# EAGLE design ehomeLight (EAGLE 8.6.3)
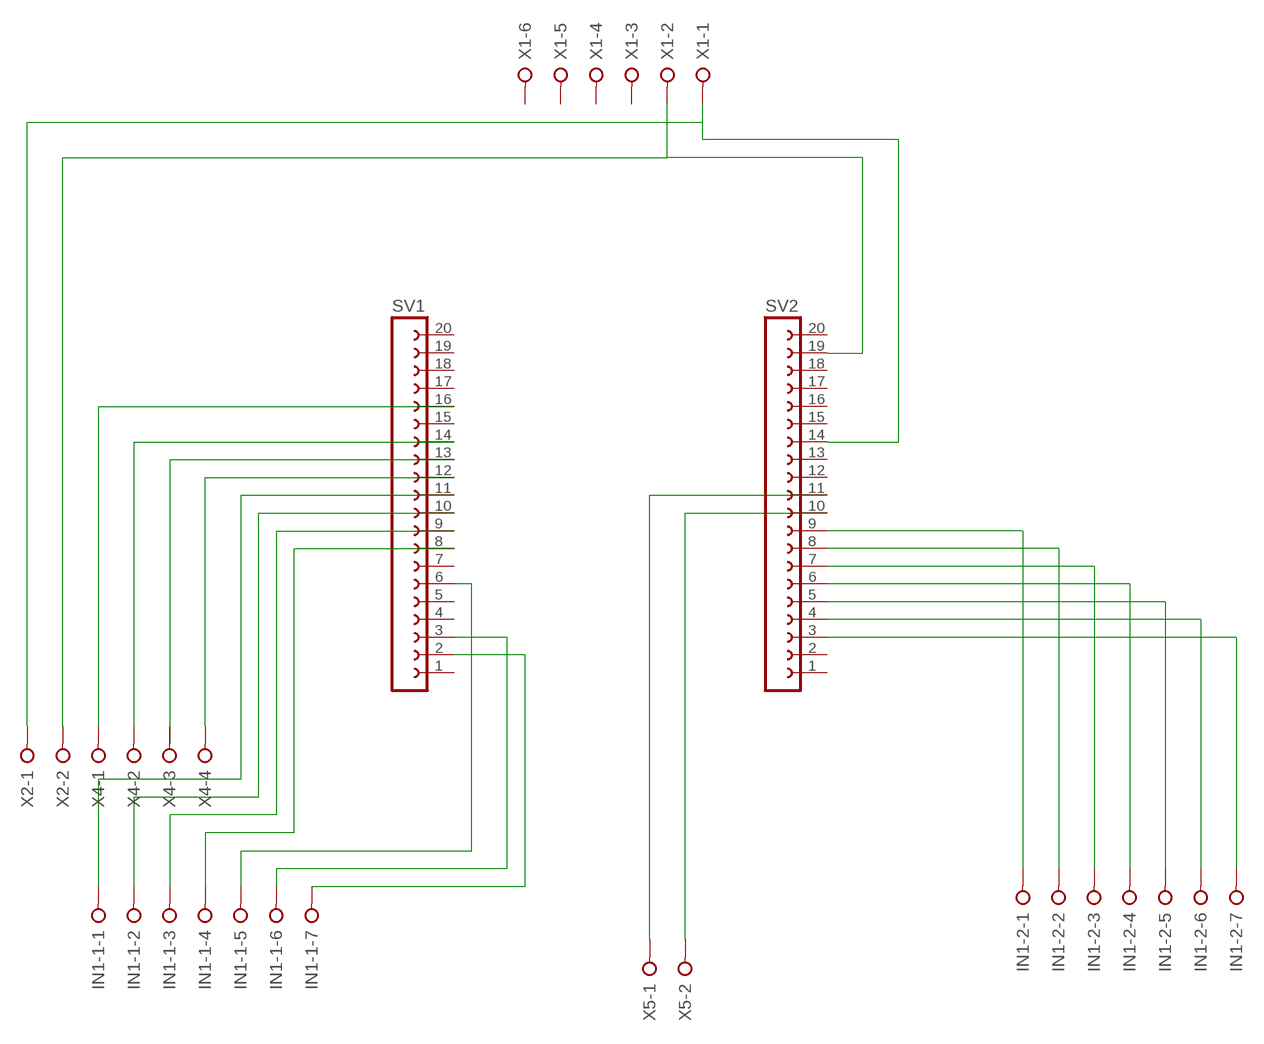
[diagram p0: schematic, sheet 1]

## Parts
IN1-1  W237-07P  [W237-7P]
IN1-2  W237-07P  [W237-7P]
SV1  FE20-1  [FE20]
SV2  FE20-1  [FE20]
X1  W237-06P  [W237-6P]
X2  W237-02P  [W237-132]
X4  W237-04P  [W237-4P]
X5  W237-02P  [W237-132]

## Nets
GND: SV2.14 X1.1 X2.1
GPIO0: SV1.14 X4.2
GPIO4: SV1.13 X4.3
GPIO5: IN1-1.2 SV1.10
GPIO15: SV1.16 X4.1
GPIO16: SV1.12 X4.4
GPIO17: IN1-1.1 SV1.11
GPIO18: IN1-1.3 SV1.9
GPIO19: IN1-1.4 SV1.8
GPIO21: IN1-1.5 SV1.6
GPIO22: IN1-1.6 SV1.3
GPIO23: IN1-1.7 SV1.2
GPIO25: IN1-2.1 SV2.9
GPIO26: SV2.10 X5.2
GPIO27: SV2.11 X5.1
GPIO32: IN1-2.3 SV2.7
GPIO33: IN1-2.2 SV2.8
GPIO34: IN1-2.5 SV2.5
GPIO35: IN1-2.4 SV2.6
GPIO36: IN1-2.7 SV2.3
GPIO39: IN1-2.6 SV2.4
PWR: SV2.19 X1.2 X2.2
Unconnected: SV1.1 SV1.4 SV1.5 SV1.7 SV1.15 SV1.17 SV1.18 SV1.19 SV1.20 SV2.1 SV2.2 SV2.12 SV2.13 SV2.15 SV2.16 SV2.17 SV2.18 SV2.20 X1.3 X1.4 X1.5 X1.6

## Library data of the parts
IN1-1 IN1-2 = con-wago-508:W237-07P: WAGO SREW CLAMP; OC_FARNELL: unknown; OC_NEWARK: unknown
SV1 SV2 = con-lsta:FE20-1: FEMALE HEADER; OC_FARNELL: unknown; OC_NEWARK: unknown
X1 = con-wago-508:W237-06P: WAGO SREW CLAMP; OC_FARNELL: unknown; OC_NEWARK: unknown
X2 X5 = con-wago-508:W237-02P: WAGO SREW CLAMP; OC_FARNELL: unknown; OC_NEWARK: unknown
X4 = con-wago-508:W237-04P: WAGO SREW CLAMP; OC_FARNELL: unknown; OC_NEWARK: unknown

## Board
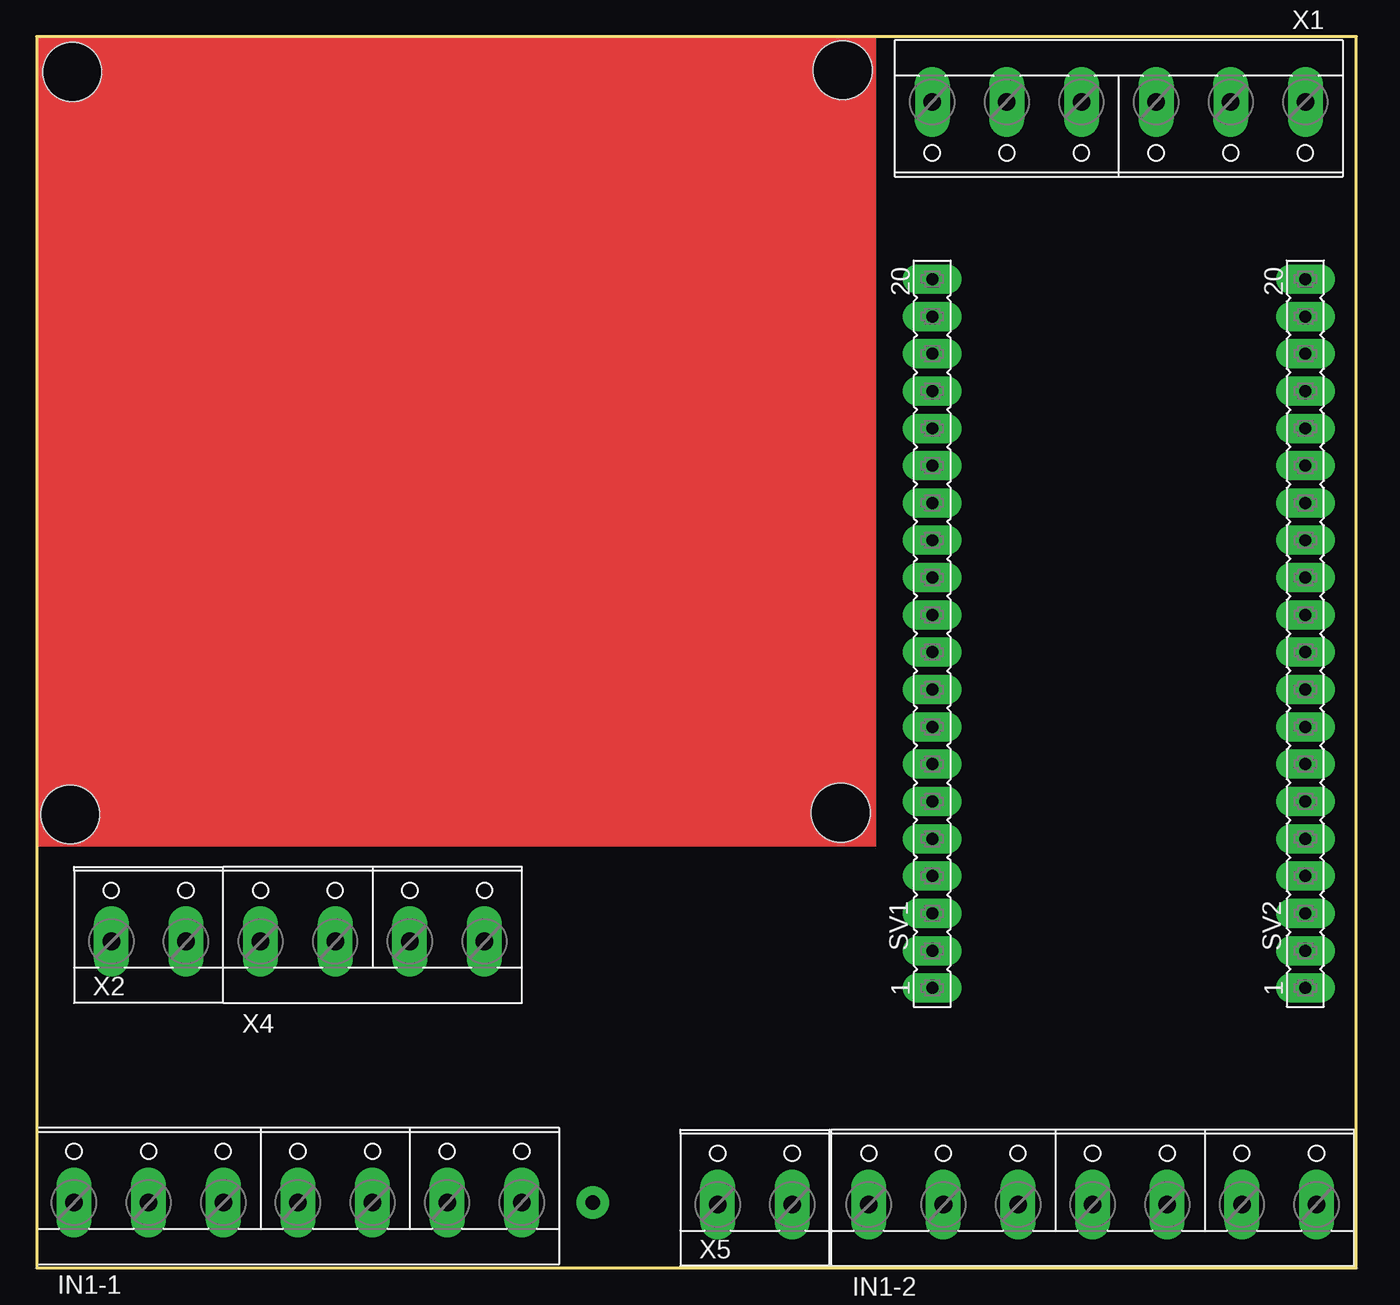
[diagram p1: board, top side]
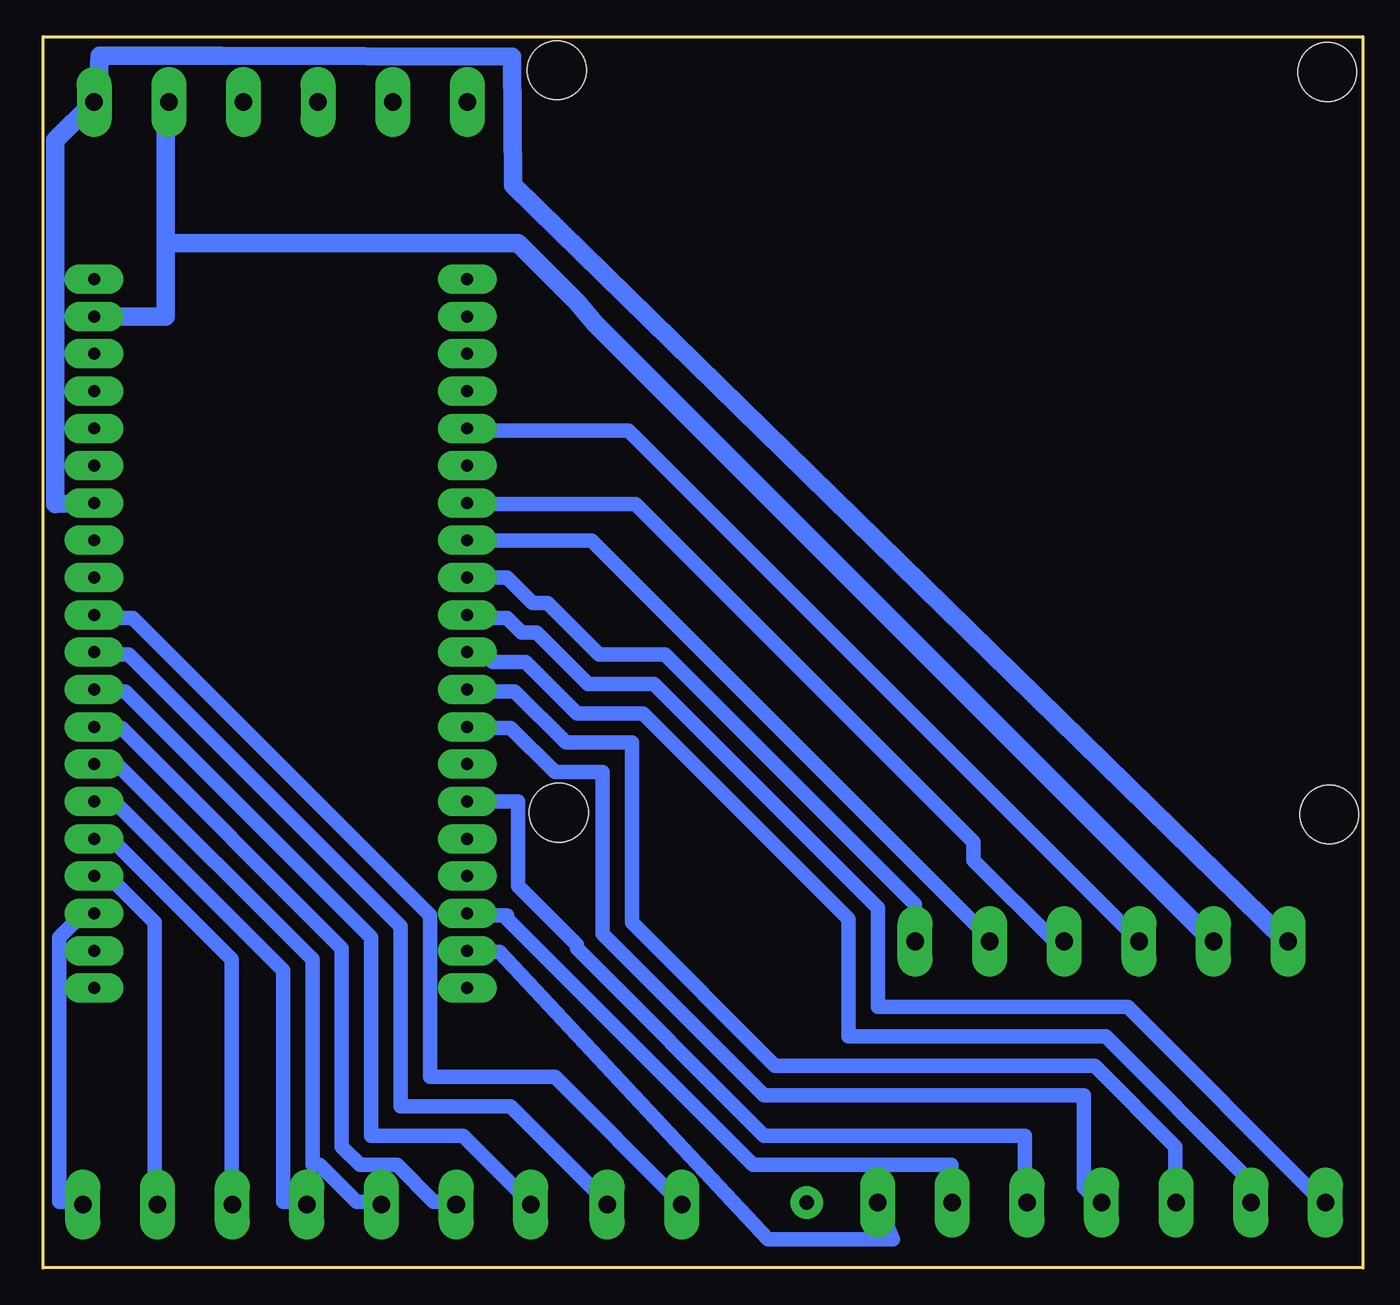
[diagram p2: board, bottom side, seen from below]

Size 89.84 x 83.81 mm. Coordinates in mm from the lower left corner, seen from the top.
Outline: 0,0 89.84,0 89.84,83.81 0,83.81 0,0
Copper layers (1*16): Top 0.035mm / dielectric 1.5mm / Bottom 0.035mm
Design rules "hobby *": minimum track width 1mm, minimum drill 1mm, track to track 0.8mm, track to pad 0.8mm, pad to pad 0.45mm, via to via 0.8mm, smd to smd 8mil, copper to edge 10mil, drill to drill 8mil, minimum pad ring 0.6mm, minimum via ring 0.6mm, stop-mask expansion 0mil, vias tented up to drill 0mil, thermal gap 10mil
Holes 4 mm at 2.41,81.41 54.86,81.53 2.29,30.86 54.74,30.99

### Footprints (pad centres in the part's own frame; a part is rotated, then mirrored left to right if it is on the bottom)
W237-7P = drill 1.194 long: 1 -15.24,-0.635; 2 -10.16,-0.635; 3 -5.08,-0.635; 4 0,-0.635; 5 5.08,-0.635; 6 10.16,-0.635; 7 15.24,-0.635
FE20 = drill 0.813 long: 1 -24.13,0; 2 -21.59,0; 3 -19.05,0; 4 -16.51,0; 5 -13.97,0; 6 -11.43,0; 7 -8.89,0; 8 -6.35,0; 9 -3.81,0; 10 -1.27,0; 11 1.27,0; 12 3.81,0; 13 6.35,0; 14 8.89,0; 15 11.43,0; 16 13.97,0; 17 16.51,0; 18 19.05,0; 19 21.59,0; 20 24.13,0
W237-6P = drill 1.194 long: 1 -12.7,-0.635; 2 -7.62,-0.635; 3 -2.54,-0.635; 4 2.54,-0.635; 5 7.62,-0.635; 6 12.7,-0.635
W237-132 = drill 1.194 long: 1 -2.54,-0.635; 2 2.54,-0.635
W237-4P = drill 1.194 long: 1 -7.62,-0.635; 2 -2.54,-0.635; 3 2.54,-0.635; 4 7.62,-0.635

### Placement (x,y rotation side)
IN1-1  17.78,5.08 0 top
IN1-2  71.88,4.95 0 top
SV1  60.96,43.18 90 top
SV2  86.36,43.18 90 top
X1  73.66,78.74 180 top
X2  7.62,22.86 0 top
X4  22.86,22.86 0 top
X5  48.9,4.95 0 top

### Tracks (layer width: path | path; a pad name or v marks a point on that pad's centre or on a via)
GND
  Bottom 1: 86.25,52.12 86.49,52.07 | 86.5,79.25 X1.1 86,79.5 | 5.25,22.25 X2.1 | SV2.14 86.5,52 86.5,52.11
  Bottom 1.27: 86.25,52.12 86.5,52.11 89,52 89,76.75 86.5,79.25 | 5.25,22.25 57.84,73.7 57.92,82.47 77.73,82.53 85.97,82.51 86,82 86,79.5
GPIO0
  Bottom 1: X4.2 20.5,22.25 21,22.25 26.5,27.75 26.5,29 49.5,52 60.75,52 SV1.14
GPIO4
  Bottom 1: SV1.13 60.75,49.5 52.5,49.5 25.25,22.25 X4.3
GPIO5
  Bottom 1: SV1.10 60.75,41.75 59.75,41.75 59.25,41.25 57,41.25 53.5,37.75 49,37.75 35,23.75 35,15.75 17.5,15.75 7.75,6 7.75,4.5 IN1-1.2
GPIO15
  Bottom 1: SV1.16 60.75,57 50,57 15.25,22.25 X4.1
GPIO16
  Bottom 1: SV1.12 60.75,47 58.25,47 56.5,45.25 55.5,45.25 52,41.75 47.5,41.75 30.5,24.75 30.5,22.25 X4.4
GPIO17
  Bottom 1: SV1.11 60.75,44.25 58.25,44.25 57.25,43.25 56.25,43.25 52.75,39.75 48.25,39.75 33,24.5 33,17.75 16,17.75 2.75,4.5 IN1-1.1
GPIO18
  Bottom 1: SV1.9 60.75,39.25 57.75,39.25 54.25,35.75 49.75,35.75 49.75,23.5 40,13.75 18.25,13.75 12.75,8.25 12.75,4.5 IN1-1.3
GPIO19
  Bottom 1: SV1.8 60.75,36.75 58,36.75 55,33.75 51.75,33.75 51.75,22.75 40.75,11.75 19,11.75 19,5.5 18,4.5 IN1-1.4
GPIO21
  Bottom 1: SV1.6 57.5,31.75 57.5,26 53.5,22 53.5,21.75 40.75,9 23,9 23,4.5 IN1-1.5
GPIO22
  Bottom 1: SV1.3 60.75,24 58.25,24 58.25,23.75 41.5,7 28,7 28,4.5 IN1-1.6
GPIO23
  Bottom 1: SV1.2 60.75,21.5 58.75,21.5 40.48,1.96 31.98,1.96 IN1-1.7
GPIO25
  Bottom 1: SV2.9 86.25,39.25 84.25,39.25 67.5,22.5 67.5,9 61.25,9 56.75,4.5 IN1-2.1
GPIO26
  Bottom 1: SV2.10 86.25,41.75 84,41.75 65.5,23.25 65.5,11 58,11 51.5,4.5 X5.2
GPIO27
  Bottom 1: SV2.11 86.25,44.25 83.75,44.25 63.5,24 63.5,13 55,13 46.5,4.5 X5.1
GPIO32
  Bottom 1: SV2.7 86.25,34.25 84.75,34.25 71.5,21 71.5,7 71,7 68.5,4.5 67,4.5 IN1-2.3
GPIO33
  Bottom 1: SV2.8 86.25,36.75 84.5,36.75 69.5,21.75 69.5,8.25 68.25,7 65.75,7 63.25,4.5 61.75,4.5 IN1-2.2
GPIO34
  Bottom 1: SV2.5 86.25,29 85,29 77,21 77,4.5 IN1-2.5
GPIO35
  Bottom 1: SV2.6 85,31.75 73.5,20.25 73.5,4.5 72,4.5 IN1-2.4
GPIO36
  Bottom 1: SV2.3 86.5,24 87.25,24 88.75,22.5 88.75,4.5 87.25,4.5 IN1-2.7
GPIO39
  Bottom 1: 82.25,4.5 IN1-2.6 82.25,5 82.25,23.5 85.25,26.5 86.25,26.5 SV2.4
PWR
  Bottom 1: 86.49,64.77 86.25,64.75 86.5,64.75 SV2.19 | 81.5,79.25 X1.2 | 10.25,22.25 X2.2
  Bottom 1.27: 86.25,64.75 81.5,64.75 81.5,69.75 | 81.5,79.25 81.5,69.75 | 10.25,22.25 52.23,64.23 53.5,65.75 57.5,69.75 81.5,69.75
S$1  (via drill 1)
  other vias: 37.85,4.45
(copper drawn outside any net)
  shapes: Top area x1